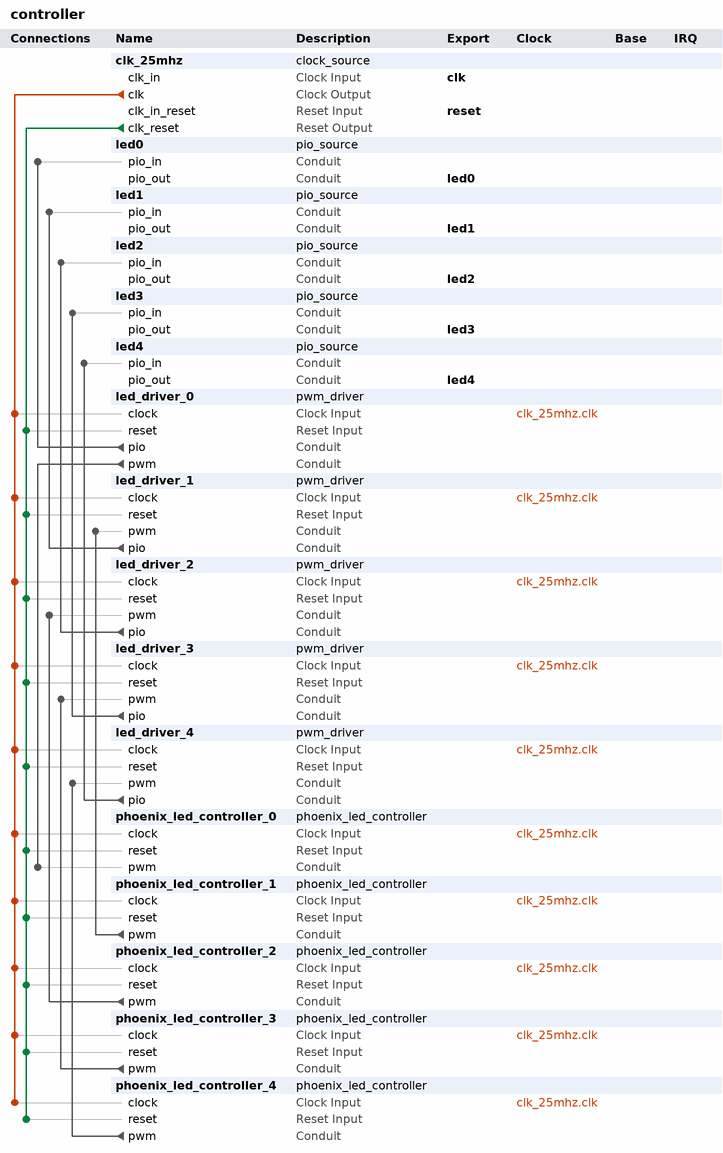
[diagram p0: system contents]
# Platform Designer (Qsys) system controller, Cyclone 10 LP 10CL025YU256C8G
# Parameters at their usual value, and those the tool derives, are not listed.
package require -exact qsys 22.1
create_system controller
set_project_property DEVICE_FAMILY {Cyclone 10 LP}
set_project_property DEVICE 10CL025YU256C8G

add_instance clk_25mhz clock_source 22.1
set_instance_parameter_value clk_25mhz clockFrequency 50000000

add_instance led0 pio_source 1.0

add_instance led1 pio_source 1.0

add_instance led2 pio_source 1.0

add_instance led3 pio_source 1.0

add_instance led4 pio_source 1.0

add_instance led_driver_0 pwm_driver 1.0
set_instance_parameter_value led_driver_0 COUNTER_BITS 32

add_instance led_driver_1 pwm_driver 1.0
set_instance_parameter_value led_driver_1 COUNTER_BITS 32

add_instance led_driver_2 pwm_driver 1.0
set_instance_parameter_value led_driver_2 COUNTER_BITS 32

add_instance led_driver_3 pwm_driver 1.0
set_instance_parameter_value led_driver_3 COUNTER_BITS 32

add_instance led_driver_4 pwm_driver 1.0
set_instance_parameter_value led_driver_4 COUNTER_BITS 32

add_instance phoenix_led_controller_0 phoenix_led_controller 1.0
set_instance_parameter_value phoenix_led_controller_0 CLOCK_FREQUENCY 25000000
set_instance_parameter_value phoenix_led_controller_0 PWM_COUNTER_BITS 32

add_instance phoenix_led_controller_1 phoenix_led_controller 1.0
set_instance_parameter_value phoenix_led_controller_1 CLOCK_FREQUENCY 25000000
set_instance_parameter_value phoenix_led_controller_1 PWM_COUNTER_BITS 32

add_instance phoenix_led_controller_2 phoenix_led_controller 1.0
set_instance_parameter_value phoenix_led_controller_2 CLOCK_FREQUENCY 25000000
set_instance_parameter_value phoenix_led_controller_2 PWM_COUNTER_BITS 32

add_instance phoenix_led_controller_3 phoenix_led_controller 1.0
set_instance_parameter_value phoenix_led_controller_3 CLOCK_FREQUENCY 25000000
set_instance_parameter_value phoenix_led_controller_3 PWM_COUNTER_BITS 32

add_instance phoenix_led_controller_4 phoenix_led_controller 1.0
set_instance_parameter_value phoenix_led_controller_4 CLOCK_FREQUENCY 25000000
set_instance_parameter_value phoenix_led_controller_4 PWM_COUNTER_BITS 32

# connections
add_connection clk_25mhz.clk led_driver_0.clock clock
add_connection clk_25mhz.clk led_driver_1.clock clock
add_connection clk_25mhz.clk led_driver_2.clock clock
add_connection clk_25mhz.clk led_driver_3.clock clock
add_connection clk_25mhz.clk led_driver_4.clock clock
add_connection clk_25mhz.clk phoenix_led_controller_0.clock clock
add_connection clk_25mhz.clk phoenix_led_controller_1.clock clock
add_connection clk_25mhz.clk phoenix_led_controller_2.clock clock
add_connection clk_25mhz.clk phoenix_led_controller_3.clock clock
add_connection clk_25mhz.clk phoenix_led_controller_4.clock clock
add_connection clk_25mhz.clk_reset led_driver_0.reset reset
add_connection clk_25mhz.clk_reset led_driver_1.reset reset
add_connection clk_25mhz.clk_reset led_driver_2.reset reset
add_connection clk_25mhz.clk_reset led_driver_3.reset reset
add_connection clk_25mhz.clk_reset led_driver_4.reset reset
add_connection clk_25mhz.clk_reset phoenix_led_controller_0.reset reset
add_connection clk_25mhz.clk_reset phoenix_led_controller_1.reset reset
add_connection clk_25mhz.clk_reset phoenix_led_controller_2.reset reset
add_connection clk_25mhz.clk_reset phoenix_led_controller_3.reset reset
add_connection clk_25mhz.clk_reset phoenix_led_controller_4.reset reset
add_connection led_driver_0.pio led0.pio_in conduit
add_connection led_driver_0.pwm phoenix_led_controller_0.pwm conduit
add_connection led_driver_1.pio led1.pio_in conduit
add_connection led_driver_2.pio led2.pio_in conduit
add_connection led_driver_3.pio led3.pio_in conduit
add_connection led_driver_4.pio led4.pio_in conduit
add_connection phoenix_led_controller_1.pwm led_driver_1.pwm conduit
add_connection phoenix_led_controller_2.pwm led_driver_2.pwm conduit
add_connection phoenix_led_controller_3.pwm led_driver_3.pwm conduit
add_connection phoenix_led_controller_4.pwm led_driver_4.pwm conduit

# exported interfaces
add_interface clk clock sink
set_interface_property clk EXPORT_OF clk_25mhz.clk_in
add_interface led0 conduit end
set_interface_property led0 EXPORT_OF led0.pio_out
add_interface led1 conduit end
set_interface_property led1 EXPORT_OF led1.pio_out
add_interface led2 conduit end
set_interface_property led2 EXPORT_OF led2.pio_out
add_interface led3 conduit end
set_interface_property led3 EXPORT_OF led3.pio_out
add_interface led4 conduit end
set_interface_property led4 EXPORT_OF led4.pio_out
add_interface reset reset sink
set_interface_property reset EXPORT_OF clk_25mhz.clk_in_reset

set_interconnect_requirement {$system} qsys_mm.clockCrossingAdapter HANDSHAKE
set_interconnect_requirement {$system} qsys_mm.enableEccProtection FALSE
set_interconnect_requirement {$system} qsys_mm.insertDefaultSlave FALSE
set_interconnect_requirement {$system} qsys_mm.maxAdditionalLatency 1

save_system controller.qsys
